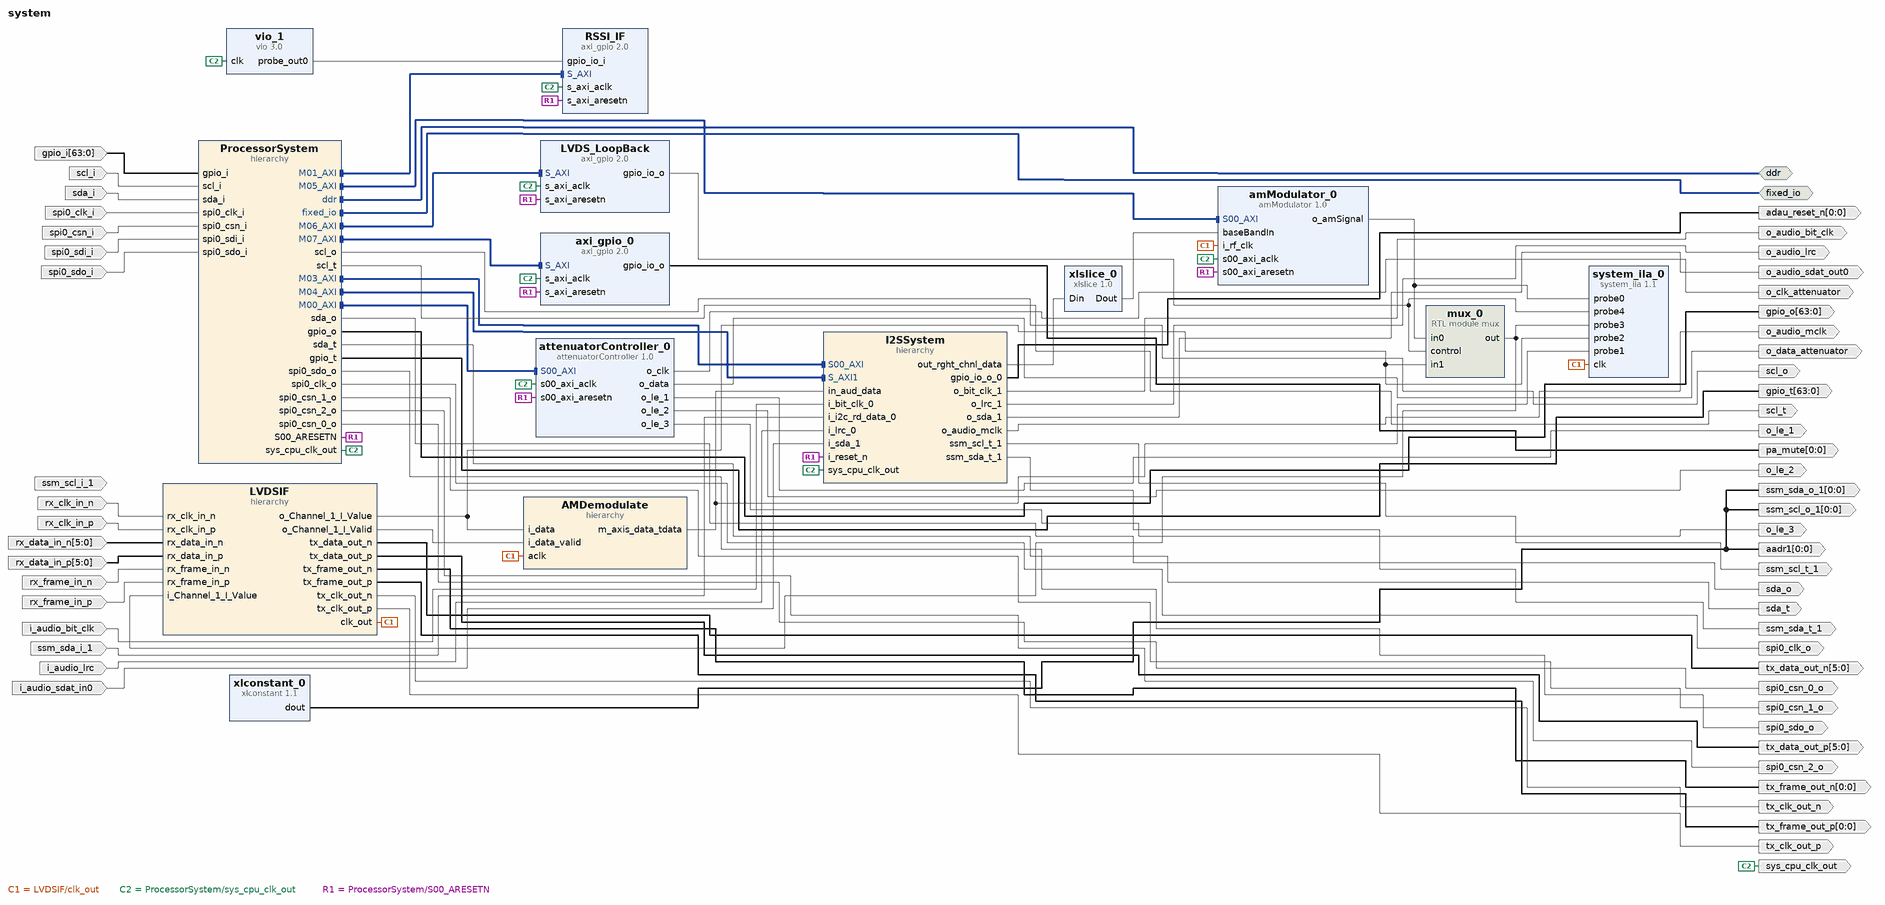
[diagram p0: block diagram of the top level]
# Vivado block design system, xc7z035ifbg676-2L, Vivado 2021.1
create_bd_design system

create_bd_intf_port -mode Master -vlnv xilinx.com:interface:ddrx_rtl:1.0 ddr
create_bd_intf_port -mode Master -vlnv xilinx.com:display_processing_system7:fixedio_rtl:1.0 fixed_io
create_bd_port -dir O spi0_csn_2_o
create_bd_port -dir O spi0_csn_1_o
create_bd_port -dir O spi0_csn_0_o
create_bd_port -dir I spi0_csn_i
create_bd_port -dir I spi0_clk_i
create_bd_port -dir O spi0_clk_o
create_bd_port -dir I spi0_sdo_i
create_bd_port -dir O spi0_sdo_o
create_bd_port -dir I spi0_sdi_i
create_bd_port -dir I -from 63 -to 0 gpio_i
create_bd_port -dir O -from 63 -to 0 gpio_o
create_bd_port -dir O -from 63 -to 0 gpio_t
create_bd_port -dir I rx_clk_in_p
create_bd_port -dir I rx_clk_in_n
create_bd_port -dir I rx_frame_in_p
create_bd_port -dir I rx_frame_in_n
create_bd_port -dir I -from 5 -to 0 rx_data_in_p
create_bd_port -dir I -from 5 -to 0 rx_data_in_n
create_bd_port -dir O tx_clk_out_p
create_bd_port -dir O tx_clk_out_n
create_bd_port -dir O -from 0 -to 0 tx_frame_out_p
create_bd_port -dir O -from 0 -to 0 tx_frame_out_n
create_bd_port -dir O -from 5 -to 0 tx_data_out_p
create_bd_port -dir O -from 5 -to 0 tx_data_out_n
create_bd_port -dir O sys_cpu_clk_out
create_bd_port -dir O sda_o
create_bd_port -dir O sda_t
create_bd_port -dir O scl_o
create_bd_port -dir O scl_t
create_bd_port -dir O -type clk o_audio_mclk
create_bd_port -dir O o_le_2
create_bd_port -dir O o_data_attenuator
create_bd_port -dir O o_le_1
create_bd_port -dir O -type clk o_clk_attenuator
set_property -dict {CONFIG.FREQ_HZ 5000000} [get_bd_ports o_clk_attenuator]
create_bd_port -dir O o_le_3
create_bd_port -dir O -type clk ssm_scl_t_1
set_property -dict {CONFIG.FREQ_HZ 100000} [get_bd_ports ssm_scl_t_1]
create_bd_port -dir O ssm_sda_t_1
create_bd_port -dir O -from 0 -to 0 ssm_scl_o_1
create_bd_port -dir O -from 0 -to 0 ssm_sda_o_1
create_bd_port -dir O -from 0 -to 0 aadr1
create_bd_port -dir I i_audio_lrc
create_bd_port -dir I -type clk i_audio_bit_clk
create_bd_port -dir I i_audio_sdat_in0
create_bd_port -dir O o_audio_lrc
create_bd_port -dir O -type clk o_audio_bit_clk
create_bd_port -dir O o_audio_sdat_out0
create_bd_port -dir O -from 0 -to 0 adau_reset_n
create_bd_port -dir I ssm_sda_i_1
create_bd_port -dir I scl_i
create_bd_port -dir I sda_i
create_bd_port -dir O -from 0 -to 0 pa_mute
create_bd_port -dir I ssm_scl_i_1

create_bd_cell -type hier ProcessorSystem
create_bd_cell -type hier LVDSIF
create_bd_cell -type hier I2SSystem
create_bd_cell -type hier AMDemodulate
create_bd_cell -type ip -vlnv xilinx.com:user:attenuatorController:1.0 attenuatorController_0
create_bd_cell -type ip -vlnv xilinx.com:ip:xlconstant:1.1 xlconstant_0
set_property -dict {CONFIG.CONST_VAL 0} [get_bd_cells xlconstant_0]
create_bd_cell -type ip -vlnv xilinx.com:ip:axi_gpio:2.0 RSSI_IF
set_property -dict {CONFIG.C_ALL_INPUTS 1 CONFIG.C_GPIO_WIDTH 16} [get_bd_cells RSSI_IF]
create_bd_cell -type ip -vlnv xilinx.com:ip:vio:3.0 vio_1
set_property -dict {CONFIG.C_NUM_PROBE_IN 0 CONFIG.C_PROBE_OUT0_WIDTH 16} [get_bd_cells vio_1]
create_bd_cell -type ip -vlnv xilinx.com:ip:axi_gpio:2.0 axi_gpio_0
set_property -dict {CONFIG.C_ALL_OUTPUTS 1 CONFIG.C_GPIO_WIDTH 1} [get_bd_cells axi_gpio_0]
create_bd_cell -type ip -vlnv xilinx.com:ip:xlslice:1.0 xlslice_0
set_property -dict {CONFIG.DIN_FROM 30 CONFIG.DIN_TO 19 CONFIG.DIN_WIDTH 31 CONFIG.DOUT_WIDTH 12} [get_bd_cells xlslice_0]
create_bd_cell -type ip -vlnv xilinx.com:ip:axi_gpio:2.0 LVDS_LoopBack
set_property -dict {CONFIG.C_ALL_OUTPUTS 1 CONFIG.C_GPIO_WIDTH 1} [get_bd_cells LVDS_LoopBack]
create_bd_cell -type module -reference mux mux_0
create_bd_cell -type ip -vlnv xilinx.com:ip:system_ila:1.1 system_ila_0
set_property -dict [list \
  CONFIG.C_DATA_DEPTH 32768 \
  CONFIG.C_MON_TYPE NATIVE \
  CONFIG.C_NUM_OF_PROBES 5 \
  CONFIG.C_PROBE0_TYPE 0 \
  CONFIG.C_PROBE1_TYPE 0 \
  CONFIG.C_PROBE2_TYPE 0 \
  CONFIG.C_PROBE3_TYPE 0 \
] [get_bd_cells system_ila_0]
create_bd_cell -type ip -vlnv xilinx.com:user:amModulator:1.0 amModulator_0

# ---- hierarchy /ProcessorSystem ----
current_bd_instance /ProcessorSystem
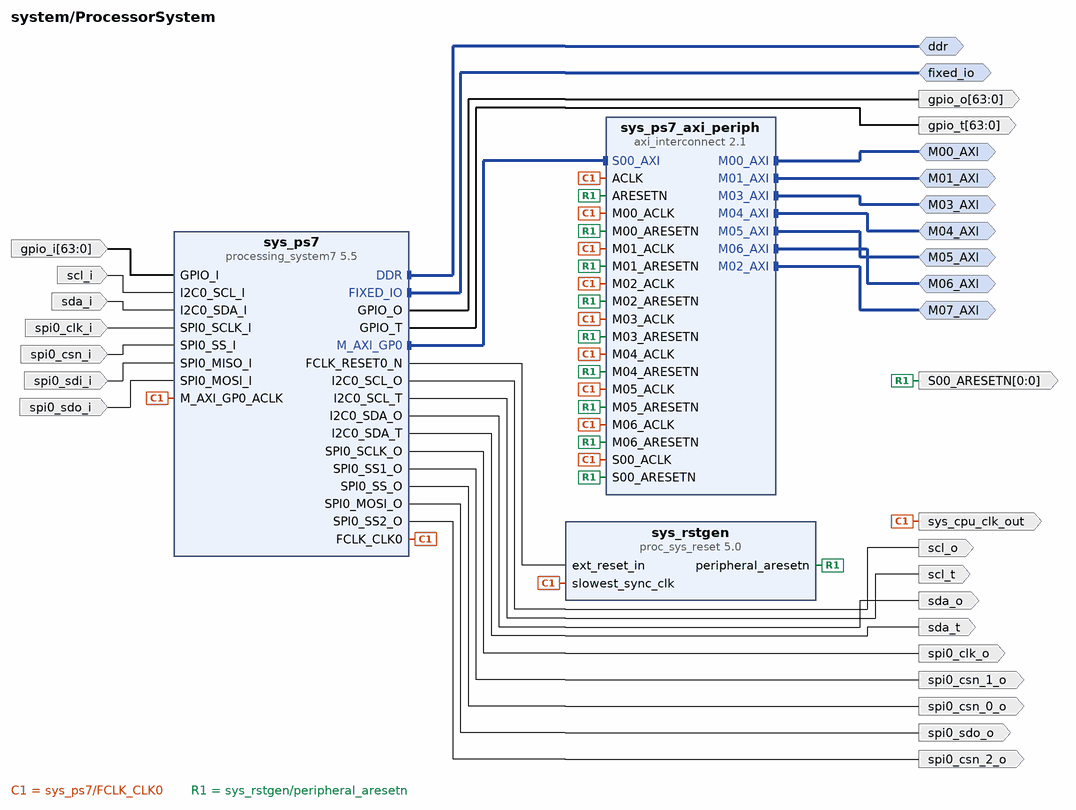
[diagram p1: block diagram inside /ProcessorSystem]
create_bd_intf_pin -mode Master -vlnv xilinx.com:interface:ddrx_rtl:1.0 ddr
create_bd_intf_pin -mode Master -vlnv xilinx.com:display_processing_system7:fixedio_rtl:1.0 fixed_io
create_bd_intf_pin -mode Master -vlnv xilinx.com:interface:aximm_rtl:1.0 M00_AXI
create_bd_intf_pin -mode Master -vlnv xilinx.com:interface:aximm_rtl:1.0 M01_AXI
create_bd_intf_pin -mode Master -vlnv xilinx.com:interface:aximm_rtl:1.0 M03_AXI
create_bd_intf_pin -mode Master -vlnv xilinx.com:interface:aximm_rtl:1.0 M04_AXI
create_bd_intf_pin -mode Master -vlnv xilinx.com:interface:aximm_rtl:1.0 M05_AXI
create_bd_intf_pin -mode Master -vlnv xilinx.com:interface:aximm_rtl:1.0 M07_AXI
create_bd_intf_pin -mode Master -vlnv xilinx.com:interface:aximm_rtl:1.0 M06_AXI
create_bd_pin -dir I -from 63 -to 0 gpio_i
create_bd_pin -dir O -from 63 -to 0 gpio_o
create_bd_pin -dir O -from 63 -to 0 gpio_t
create_bd_pin -dir I spi0_clk_i
create_bd_pin -dir O spi0_clk_o
create_bd_pin -dir I spi0_sdo_i
create_bd_pin -dir O spi0_sdo_o
create_bd_pin -dir I spi0_sdi_i
create_bd_pin -dir I spi0_csn_i
create_bd_pin -dir O spi0_csn_0_o
create_bd_pin -dir O spi0_csn_1_o
create_bd_pin -dir O spi0_csn_2_o
create_bd_pin -dir O -type clk sys_cpu_clk_out
create_bd_pin -dir O -from 0 -to 0 -type rst S00_ARESETN
create_bd_pin -dir I scl_i
create_bd_pin -dir I sda_i
create_bd_pin -dir O sda_o
create_bd_pin -dir O sda_t
create_bd_pin -dir O scl_o
create_bd_pin -dir O scl_t

create_bd_cell -type ip -vlnv xilinx.com:ip:processing_system7:5.5 sys_ps7
set_property -dict [list \
  CONFIG.PCW_APU_PERIPHERAL_FREQMHZ 666.666666 \
  CONFIG.PCW_CPU_CPU_6X4X_MAX_RANGE 800 \
  CONFIG.PCW_ENET0_PERIPHERAL_ENABLE 0 \
  CONFIG.PCW_ENET1_PERIPHERAL_CLKSRC External \
  CONFIG.PCW_EN_RST1_PORT 1 \
  CONFIG.PCW_EN_RST2_PORT 1 \
  CONFIG.PCW_FPGA0_PERIPHERAL_FREQMHZ 100.0 \
  CONFIG.PCW_FPGA1_PERIPHERAL_FREQMHZ 200.0 \
  CONFIG.PCW_FPGA2_PERIPHERAL_FREQMHZ 200.0 \
  CONFIG.PCW_GPIO_EMIO_GPIO_ENABLE 1 \
  CONFIG.PCW_GPIO_EMIO_GPIO_IO 64 \
  CONFIG.PCW_GPIO_MIO_GPIO_ENABLE 1 \
  CONFIG.PCW_GPIO_MIO_GPIO_IO MIO \
  CONFIG.PCW_I2C0_I2C0_IO EMIO \
  CONFIG.PCW_I2C0_PERIPHERAL_ENABLE 1 \
  CONFIG.PCW_I2C_PERIPHERAL_FREQMHZ 111.111115 \
  CONFIG.PCW_I2C_RESET_ENABLE 1 \
  CONFIG.PCW_I2C_RESET_SELECT {Share reset pin} \
  CONFIG.PCW_IRQ_F2P_MODE REVERSE \
  CONFIG.PCW_PERIPHERAL_BOARD_PRESET None \
  CONFIG.PCW_PRESET_BANK0_VOLTAGE {LVCMOS 1.8V} \
  CONFIG.PCW_PRESET_BANK1_VOLTAGE {LVCMOS 1.8V} \
  CONFIG.PCW_QSPI_GRP_SINGLE_SS_ENABLE 1 \
  CONFIG.PCW_QSPI_GRP_SINGLE_SS_IO {MIO 1 .. 6} \
  CONFIG.PCW_QSPI_PERIPHERAL_ENABLE 1 \
  CONFIG.PCW_QSPI_QSPI_IO {MIO 1 .. 6} \
  CONFIG.PCW_SD0_GRP_CD_ENABLE 1 \
  CONFIG.PCW_SD0_GRP_CD_IO {MIO 50} \
  CONFIG.PCW_SD0_GRP_WP_ENABLE 0 \
  CONFIG.PCW_SD0_PERIPHERAL_ENABLE 1 \
  CONFIG.PCW_SD0_SD0_IO {MIO 40 .. 45} \
  CONFIG.PCW_SDIO_PERIPHERAL_FREQMHZ 50 \
  CONFIG.PCW_SINGLE_QSPI_DATA_MODE x4 \
  CONFIG.PCW_SPI0_PERIPHERAL_ENABLE 1 \
  CONFIG.PCW_SPI0_SPI0_IO EMIO \
  CONFIG.PCW_SPI1_PERIPHERAL_ENABLE 1 \
  CONFIG.PCW_SPI1_SPI1_IO EMIO \
  CONFIG.PCW_UART1_PERIPHERAL_ENABLE 1 \
  CONFIG.PCW_UART1_UART1_IO {MIO 48 .. 49} \
  CONFIG.PCW_UART_PERIPHERAL_FREQMHZ 100 \
  CONFIG.PCW_UIPARAM_DDR_FREQ_MHZ 533.333333 \
  CONFIG.PCW_UIPARAM_DDR_PARTNO {MT41K256M16 RE-125} \
  CONFIG.PCW_USB0_PERIPHERAL_ENABLE 0 \
  CONFIG.PCW_USB_RESET_ENABLE 1 \
  CONFIG.preset None \
] [get_bd_cells sys_ps7]
# 494 more settings of sys_ps7 are not shown: defaults, MIO pin electricals, DDR timing, and values the tool derives
create_bd_cell -type ip -vlnv xilinx.com:ip:proc_sys_reset:5.0 sys_rstgen
set_property -dict {CONFIG.C_EXT_RST_WIDTH 1} [get_bd_cells sys_rstgen]
create_bd_cell -type ip -vlnv xilinx.com:ip:axi_interconnect:2.1 sys_ps7_axi_periph
set_property -dict {CONFIG.NUM_MI 7} [get_bd_cells sys_ps7_axi_periph]

# ---- hierarchy /LVDSIF ----
current_bd_instance /LVDSIF
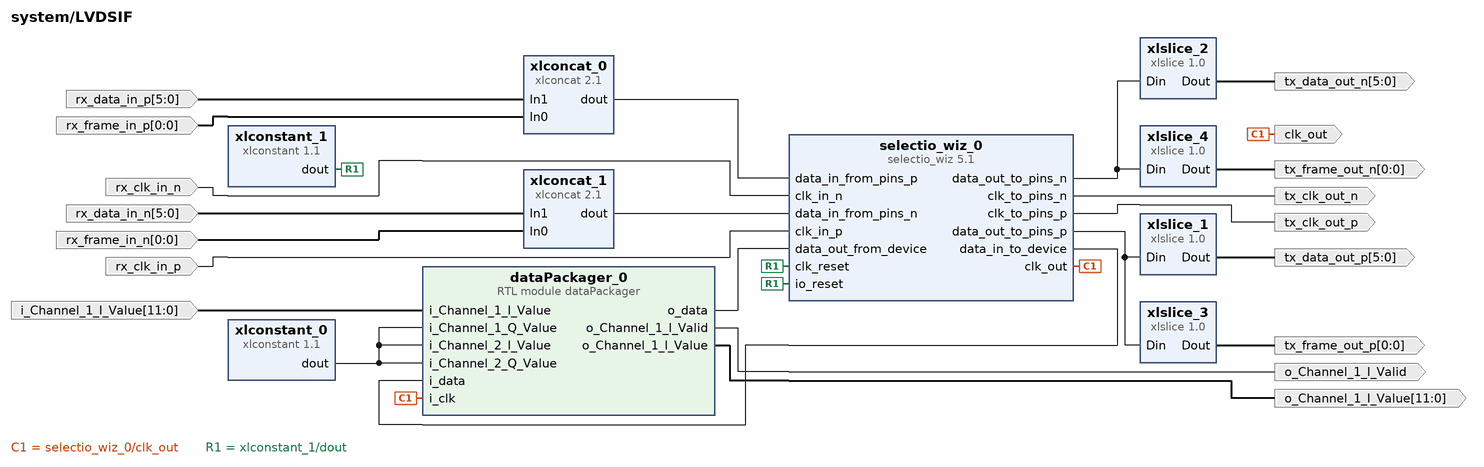
[diagram p2: block diagram inside /LVDSIF]
create_bd_pin -dir I -from 5 -to 0 rx_data_in_p
create_bd_pin -dir I -from 0 -to 0 rx_frame_in_p
create_bd_pin -dir I -from 5 -to 0 rx_data_in_n
create_bd_pin -dir I -from 0 -to 0 rx_frame_in_n
create_bd_pin -dir I -from 11 -to 0 i_Channel_1_I_Value
create_bd_pin -dir I -type clk rx_clk_in_p
create_bd_pin -dir I -type clk rx_clk_in_n
create_bd_pin -dir O -type clk tx_clk_out_p
create_bd_pin -dir O -type clk tx_clk_out_n
create_bd_pin -dir O -from 0 -to 0 tx_frame_out_p
create_bd_pin -dir O -from 5 -to 0 tx_data_out_p
create_bd_pin -dir O -from 5 -to 0 tx_data_out_n
create_bd_pin -dir O -from 0 -to 0 tx_frame_out_n
create_bd_pin -dir O -from 11 -to 0 o_Channel_1_I_Value
create_bd_pin -dir O o_Channel_1_I_Valid
create_bd_pin -dir O -type clk clk_out

create_bd_cell -type ip -vlnv xilinx.com:ip:selectio_wiz:5.1 selectio_wiz_0
set_property -dict [list \
  CONFIG.BUS_DIR SEPARATE \
  CONFIG.BUS_IO_STD LVDS \
  CONFIG.BUS_SIG_TYPE DIFF \
  CONFIG.CLK_FWD true \
  CONFIG.CLK_FWD_IO_STD LVDS \
  CONFIG.CLK_FWD_SIG_TYPE DIFF \
  CONFIG.SELIO_ACTIVE_EDGE DDR \
  CONFIG.SELIO_BUS_IN_DELAY NONE \
  CONFIG.SELIO_CLK_IO_STD LVDS \
  CONFIG.SELIO_CLK_SIG_TYPE DIFF \
  CONFIG.SELIO_INTERFACE_TYPE NETWORKING \
  CONFIG.SERIALIZATION_FACTOR 4 \
  CONFIG.SYSTEM_DATA_WIDTH 7 \
] [get_bd_cells selectio_wiz_0]
create_bd_cell -type ip -vlnv xilinx.com:ip:xlconcat:2.1 xlconcat_0
set_property -dict {CONFIG.dout_width 7} [get_bd_cells xlconcat_0]
create_bd_cell -type ip -vlnv xilinx.com:ip:xlconcat:2.1 xlconcat_1
set_property -dict {CONFIG.dout_width 7} [get_bd_cells xlconcat_1]
create_bd_cell -type ip -vlnv xilinx.com:ip:xlconstant:1.1 xlconstant_0
set_property -dict {CONFIG.CONST_VAL 0 CONFIG.CONST_WIDTH 12} [get_bd_cells xlconstant_0]
create_bd_cell -type ip -vlnv xilinx.com:ip:xlconstant:1.1 xlconstant_1
set_property -dict {CONFIG.CONST_VAL 0} [get_bd_cells xlconstant_1]
create_bd_cell -type ip -vlnv xilinx.com:ip:xlslice:1.0 xlslice_1
set_property -dict {CONFIG.DIN_FROM 6 CONFIG.DIN_TO 1 CONFIG.DIN_WIDTH 7 CONFIG.DOUT_WIDTH 6} [get_bd_cells xlslice_1]
create_bd_cell -type ip -vlnv xilinx.com:ip:xlslice:1.0 xlslice_2
set_property -dict {CONFIG.DIN_FROM 6 CONFIG.DIN_TO 1 CONFIG.DIN_WIDTH 7 CONFIG.DOUT_WIDTH 6} [get_bd_cells xlslice_2]
create_bd_cell -type ip -vlnv xilinx.com:ip:xlslice:1.0 xlslice_3
set_property -dict {CONFIG.DIN_FROM 0 CONFIG.DIN_TO 0 CONFIG.DIN_WIDTH 7 CONFIG.DOUT_WIDTH 1} [get_bd_cells xlslice_3]
create_bd_cell -type ip -vlnv xilinx.com:ip:xlslice:1.0 xlslice_4
set_property -dict {CONFIG.DIN_FROM 0 CONFIG.DIN_TO 0 CONFIG.DIN_WIDTH 7 CONFIG.DOUT_WIDTH 1} [get_bd_cells xlslice_4]
create_bd_cell -type module -reference dataPackager dataPackager_0

# ---- hierarchy /I2SSystem ----
current_bd_instance /I2SSystem
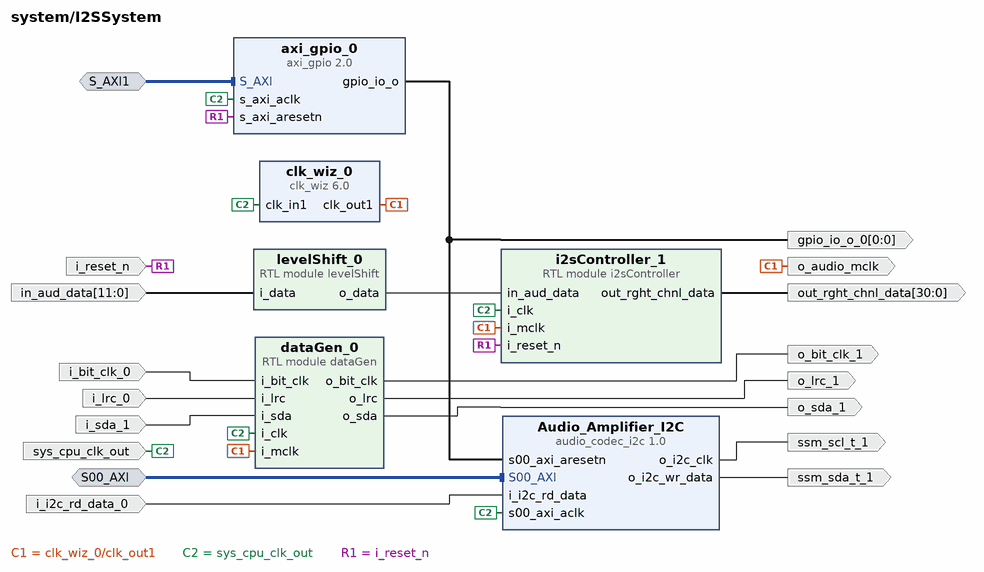
[diagram p3: block diagram inside /I2SSystem]
create_bd_intf_pin -mode Slave -vlnv xilinx.com:interface:aximm_rtl:1.0 S_AXI1
create_bd_intf_pin -mode Slave -vlnv xilinx.com:interface:aximm_rtl:1.0 S00_AXI
create_bd_pin -dir I -type clk sys_cpu_clk_out
create_bd_pin -dir I i_reset_n
create_bd_pin -dir O -from 30 -to 0 out_rght_chnl_data
create_bd_pin -dir I -from 11 -to 0 in_aud_data
create_bd_pin -dir I i_lrc_0
create_bd_pin -dir I -type clk i_bit_clk_0
create_bd_pin -dir I i_sda_1
create_bd_pin -dir O o_lrc_1
create_bd_pin -dir O -type clk o_bit_clk_1
create_bd_pin -dir O o_sda_1
create_bd_pin -dir O -from 0 -to 0 gpio_io_o_0
create_bd_pin -dir O ssm_sda_t_1
create_bd_pin -dir O -type clk ssm_scl_t_1
create_bd_pin -dir I i_i2c_rd_data_0
create_bd_pin -dir O -type clk o_audio_mclk

create_bd_cell -type module -reference dataGen dataGen_0
create_bd_cell -type ip -vlnv xilinx.com:ip:axi_gpio:2.0 axi_gpio_0
set_property -dict {CONFIG.C_ALL_OUTPUTS 1 CONFIG.C_DOUT_DEFAULT 0x00000001 CONFIG.C_GPIO_WIDTH 1} [get_bd_cells axi_gpio_0]
create_bd_cell -type ip -vlnv xilinx.com:user:audio_codec_i2c:1.0 Audio_Amplifier_I2C
create_bd_cell -type ip -vlnv xilinx.com:ip:clk_wiz:6.0 clk_wiz_0
set_property -dict [list \
  CONFIG.CLKOUT1_JITTER 360.948 \
  CONFIG.CLKOUT1_PHASE_ERROR 301.601 \
  CONFIG.CLKOUT1_REQUESTED_OUT_FREQ 12.288 \
  CONFIG.CLKOUT2_JITTER 287.104 \
  CONFIG.CLKOUT2_PHASE_ERROR 318.151 \
  CONFIG.CLKOUT2_REQUESTED_OUT_FREQ 128 \
  CONFIG.CLKOUT2_USED false \
  CONFIG.CLKOUT3_JITTER 535.299 \
  CONFIG.CLKOUT3_PHASE_ERROR 318.151 \
  CONFIG.CLKOUT3_REQUESTED_OUT_FREQ 5 \
  CONFIG.CLKOUT3_USED false \
  CONFIG.MMCM_CLKFBOUT_MULT_F 48.000 \
  CONFIG.MMCM_CLKOUT0_DIVIDE_F 78.125 \
  CONFIG.MMCM_CLKOUT1_DIVIDE 1 \
  CONFIG.MMCM_CLKOUT2_DIVIDE 1 \
  CONFIG.MMCM_DIVCLK_DIVIDE 5 \
  CONFIG.NUM_OUT_CLKS 1 \
  CONFIG.USE_LOCKED false \
  CONFIG.USE_RESET false \
] [get_bd_cells clk_wiz_0]
create_bd_cell -type module -reference i2sController i2sController_1
create_bd_cell -type module -reference levelShift levelShift_0

# ---- hierarchy /AMDemodulate ----
current_bd_instance /AMDemodulate
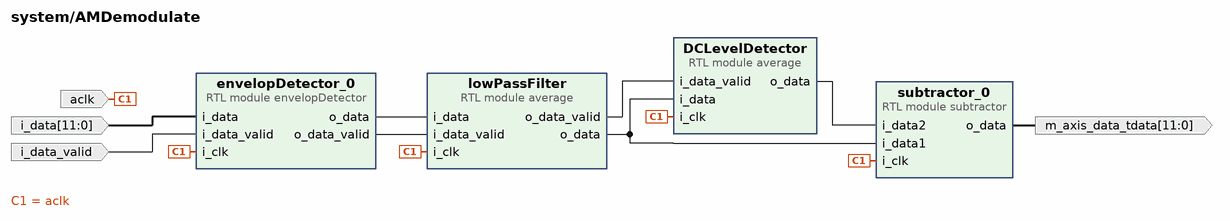
[diagram p4: block diagram inside /AMDemodulate]
create_bd_pin -dir I -type clk aclk
create_bd_pin -dir O -from 11 -to 0 m_axis_data_tdata
create_bd_pin -dir I -from 11 -to 0 i_data
create_bd_pin -dir I i_data_valid

create_bd_cell -type module -reference envelopDetector envelopDetector_0
create_bd_cell -type module -reference average lowPassFilter
create_bd_cell -type module -reference average DCLevelDetector
set_property -dict {CONFIG.numSamples 32768} [get_bd_cells DCLevelDetector]
create_bd_cell -type module -reference subtractor subtractor_0

# ---- connections ----

current_bd_instance /ProcessorSystem
connect_bd_intf_net [get_bd_intf_pins M03_AXI] [get_bd_intf_pins sys_ps7_axi_periph/M03_AXI]
connect_bd_intf_net [get_bd_intf_pins M04_AXI] [get_bd_intf_pins sys_ps7_axi_periph/M04_AXI]
connect_bd_intf_net [get_bd_intf_pins M06_AXI] [get_bd_intf_pins sys_ps7_axi_periph/M06_AXI]
connect_bd_intf_net [get_bd_intf_pins ddr] [get_bd_intf_pins sys_ps7/DDR]
connect_bd_intf_net [get_bd_intf_pins fixed_io] [get_bd_intf_pins sys_ps7/FIXED_IO]
connect_bd_intf_net [get_bd_intf_pins sys_ps7/M_AXI_GP0] [get_bd_intf_pins sys_ps7_axi_periph/S00_AXI]
connect_bd_intf_net [get_bd_intf_pins M00_AXI] [get_bd_intf_pins sys_ps7_axi_periph/M00_AXI]
connect_bd_intf_net [get_bd_intf_pins M01_AXI] [get_bd_intf_pins sys_ps7_axi_periph/M01_AXI]
connect_bd_intf_net [get_bd_intf_pins M07_AXI] [get_bd_intf_pins sys_ps7_axi_periph/M02_AXI]
connect_bd_intf_net [get_bd_intf_pins M05_AXI] [get_bd_intf_pins sys_ps7_axi_periph/M05_AXI]
connect_bd_net [get_bd_pins gpio_i] [get_bd_pins sys_ps7/GPIO_I]
connect_bd_net [get_bd_pins scl_i] [get_bd_pins sys_ps7/I2C0_SCL_I]
connect_bd_net [get_bd_pins sda_i] [get_bd_pins sys_ps7/I2C0_SDA_I]
connect_bd_net [get_bd_pins spi0_clk_i] [get_bd_pins sys_ps7/SPI0_SCLK_I]
connect_bd_net [get_bd_pins spi0_csn_i] [get_bd_pins sys_ps7/SPI0_SS_I]
connect_bd_net [get_bd_pins spi0_sdi_i] [get_bd_pins sys_ps7/SPI0_MISO_I]
connect_bd_net [get_bd_pins spi0_sdo_i] [get_bd_pins sys_ps7/SPI0_MOSI_I]
connect_bd_net -net sys_cpu_clk [get_bd_pins sys_ps7/FCLK_CLK0] \
  [get_bd_pins sys_cpu_clk_out] [get_bd_pins sys_rstgen/slowest_sync_clk] [get_bd_pins sys_ps7/M_AXI_GP0_ACLK] \
  [get_bd_pins sys_ps7_axi_periph/ACLK] [get_bd_pins sys_ps7_axi_periph/S00_ACLK] [get_bd_pins sys_ps7_axi_periph/M00_ACLK] \
  [get_bd_pins sys_ps7_axi_periph/M01_ACLK] [get_bd_pins sys_ps7_axi_periph/M02_ACLK] \
  [get_bd_pins sys_ps7_axi_periph/M03_ACLK] [get_bd_pins sys_ps7_axi_periph/M04_ACLK] \
  [get_bd_pins sys_ps7_axi_periph/M05_ACLK] [get_bd_pins sys_ps7_axi_periph/M06_ACLK]
connect_bd_net -net sys_cpu_resetn [get_bd_pins sys_rstgen/peripheral_aresetn] \
  [get_bd_pins S00_ARESETN] [get_bd_pins sys_ps7_axi_periph/ARESETN] [get_bd_pins sys_ps7_axi_periph/S00_ARESETN] \
  [get_bd_pins sys_ps7_axi_periph/M00_ARESETN] [get_bd_pins sys_ps7_axi_periph/M01_ARESETN] \
  [get_bd_pins sys_ps7_axi_periph/M02_ARESETN] [get_bd_pins sys_ps7_axi_periph/M03_ARESETN] \
  [get_bd_pins sys_ps7_axi_periph/M04_ARESETN] [get_bd_pins sys_ps7_axi_periph/M05_ARESETN] \
  [get_bd_pins sys_ps7_axi_periph/M06_ARESETN]
connect_bd_net [get_bd_pins sys_ps7/FCLK_RESET0_N] [get_bd_pins sys_rstgen/ext_reset_in]
connect_bd_net [get_bd_pins sys_ps7/GPIO_O] [get_bd_pins gpio_o]
connect_bd_net [get_bd_pins sys_ps7/GPIO_T] [get_bd_pins gpio_t]
connect_bd_net [get_bd_pins sys_ps7/I2C0_SCL_O] [get_bd_pins scl_o]
connect_bd_net [get_bd_pins sys_ps7/I2C0_SCL_T] [get_bd_pins scl_t]
connect_bd_net [get_bd_pins sys_ps7/I2C0_SDA_O] [get_bd_pins sda_o]
connect_bd_net [get_bd_pins sys_ps7/I2C0_SDA_T] [get_bd_pins sda_t]
connect_bd_net [get_bd_pins sys_ps7/SPI0_MOSI_O] [get_bd_pins spi0_sdo_o]
connect_bd_net [get_bd_pins sys_ps7/SPI0_SCLK_O] [get_bd_pins spi0_clk_o]
connect_bd_net [get_bd_pins sys_ps7/SPI0_SS1_O] [get_bd_pins spi0_csn_1_o]
connect_bd_net [get_bd_pins sys_ps7/SPI0_SS2_O] [get_bd_pins spi0_csn_2_o]
connect_bd_net [get_bd_pins sys_ps7/SPI0_SS_O] [get_bd_pins spi0_csn_0_o]
set_property HDL_ATTRIBUTE.BMM_INFO_PROCESSOR {arm > system axi_bram_ctrl_0} [get_bd_cells sys_ps7]
set_property HDL_ATTRIBUTE.KEEP_HIERARCHY yes [get_bd_cells sys_ps7]

current_bd_instance /LVDSIF
connect_bd_net -net amModulator_0_o_amSignal [get_bd_pins i_Channel_1_I_Value] [get_bd_pins dataPackager_0/i_Channel_1_I_Value]
connect_bd_net [get_bd_pins dataPackager_0/o_Channel_1_I_Valid] [get_bd_pins o_Channel_1_I_Valid]
connect_bd_net -net dataPackager_0_o_Channel_1_I_Value [get_bd_pins dataPackager_0/o_Channel_1_I_Value] [get_bd_pins o_Channel_1_I_Value]
connect_bd_net [get_bd_pins dataPackager_0/o_data] [get_bd_pins selectio_wiz_0/data_out_from_device]
connect_bd_net [get_bd_pins rx_clk_in_n] [get_bd_pins selectio_wiz_0/clk_in_n]
connect_bd_net [get_bd_pins rx_clk_in_p] [get_bd_pins selectio_wiz_0/clk_in_p]
connect_bd_net [get_bd_pins rx_data_in_n] [get_bd_pins xlconcat_1/In1]
connect_bd_net [get_bd_pins rx_data_in_p] [get_bd_pins xlconcat_0/In1]
connect_bd_net [get_bd_pins rx_frame_in_n] [get_bd_pins xlconcat_1/In0]
connect_bd_net [get_bd_pins rx_frame_in_p] [get_bd_pins xlconcat_0/In0]
connect_bd_net [get_bd_pins selectio_wiz_0/clk_out] [get_bd_pins clk_out] [get_bd_pins dataPackager_0/i_clk]
connect_bd_net [get_bd_pins selectio_wiz_0/clk_to_pins_n] [get_bd_pins tx_clk_out_n]
connect_bd_net [get_bd_pins selectio_wiz_0/clk_to_pins_p] [get_bd_pins tx_clk_out_p]
connect_bd_net [get_bd_pins selectio_wiz_0/data_in_to_device] [get_bd_pins dataPackager_0/i_data]
connect_bd_net [get_bd_pins selectio_wiz_0/data_out_to_pins_n] [get_bd_pins xlslice_2/Din] [get_bd_pins xlslice_4/Din]
connect_bd_net [get_bd_pins selectio_wiz_0/data_out_to_pins_p] [get_bd_pins xlslice_1/Din] [get_bd_pins xlslice_3/Din]
connect_bd_net [get_bd_pins xlconcat_0/dout] [get_bd_pins selectio_wiz_0/data_in_from_pins_p]
connect_bd_net [get_bd_pins xlconcat_1/dout] [get_bd_pins selectio_wiz_0/data_in_from_pins_n]
connect_bd_net [get_bd_pins xlconstant_0/dout] \
  [get_bd_pins dataPackager_0/i_Channel_1_Q_Value] [get_bd_pins dataPackager_0/i_Channel_2_I_Value] \
  [get_bd_pins dataPackager_0/i_Channel_2_Q_Value]
connect_bd_net [get_bd_pins xlconstant_1/dout] [get_bd_pins selectio_wiz_0/clk_reset] [get_bd_pins selectio_wiz_0/io_reset]
connect_bd_net [get_bd_pins xlslice_1/Dout] [get_bd_pins tx_data_out_p]
connect_bd_net [get_bd_pins xlslice_2/Dout] [get_bd_pins tx_data_out_n]
connect_bd_net [get_bd_pins xlslice_3/Dout] [get_bd_pins tx_frame_out_p]
connect_bd_net [get_bd_pins xlslice_4/Dout] [get_bd_pins tx_frame_out_n]
set_property HDL_ATTRIBUTE.DEBUG true [get_bd_nets amModulator_0_o_amSignal]
set_property HDL_ATTRIBUTE.DEBUG true [get_bd_nets dataPackager_0_o_Channel_1_I_Value]

current_bd_instance /I2SSystem
connect_bd_intf_net [get_bd_intf_pins S_AXI1] [get_bd_intf_pins axi_gpio_0/S_AXI]
connect_bd_intf_net [get_bd_intf_pins S00_AXI] [get_bd_intf_pins Audio_Amplifier_I2C/S00_AXI]
connect_bd_net [get_bd_pins Audio_Amplifier_I2C/o_i2c_clk] [get_bd_pins ssm_scl_t_1]
connect_bd_net [get_bd_pins Audio_Amplifier_I2C/o_i2c_wr_data] [get_bd_pins ssm_sda_t_1]
connect_bd_net [get_bd_pins axi_gpio_0/gpio_io_o] [get_bd_pins gpio_io_o_0] [get_bd_pins Audio_Amplifier_I2C/s00_axi_aresetn]
connect_bd_net [get_bd_pins clk_wiz_0/clk_out1] [get_bd_pins o_audio_mclk] [get_bd_pins dataGen_0/i_mclk] [get_bd_pins i2sController_1/i_mclk]
connect_bd_net [get_bd_pins dataGen_0/o_bit_clk] [get_bd_pins o_bit_clk_1]
connect_bd_net [get_bd_pins dataGen_0/o_lrc] [get_bd_pins o_lrc_1]
connect_bd_net [get_bd_pins dataGen_0/o_sda] [get_bd_pins o_sda_1]
connect_bd_net [get_bd_pins i2sController_1/out_rght_chnl_data] [get_bd_pins out_rght_chnl_data]
connect_bd_net -net i_bit_clk_0_1 [get_bd_pins i_bit_clk_0] [get_bd_pins dataGen_0/i_bit_clk]
connect_bd_net -net i_i2c_rd_data_0_1 [get_bd_pins i_i2c_rd_data_0] [get_bd_pins Audio_Amplifier_I2C/i_i2c_rd_data]
connect_bd_net -net i_lrc_0_1 [get_bd_pins i_lrc_0] [get_bd_pins dataGen_0/i_lrc]
connect_bd_net -net i_sda_1_1 [get_bd_pins i_sda_1] [get_bd_pins dataGen_0/i_sda]
connect_bd_net -net in_aud_data_1 [get_bd_pins in_aud_data] [get_bd_pins levelShift_0/i_data]
connect_bd_net [get_bd_pins levelShift_0/o_data] [get_bd_pins i2sController_1/in_aud_data]
connect_bd_net -net sys_cpu_clk [get_bd_pins sys_cpu_clk_out] \
  [get_bd_pins dataGen_0/i_clk] [get_bd_pins axi_gpio_0/s_axi_aclk] [get_bd_pins Audio_Amplifier_I2C/s00_axi_aclk] \
  [get_bd_pins clk_wiz_0/clk_in1] [get_bd_pins i2sController_1/i_clk]
connect_bd_net -net sys_cpu_resetn [get_bd_pins i_reset_n] [get_bd_pins axi_gpio_0/s_axi_aresetn] [get_bd_pins i2sController_1/i_reset_n]
set_property HDL_ATTRIBUTE.DEBUG true [get_bd_nets in_aud_data_1]

current_bd_instance /AMDemodulate
connect_bd_net [get_bd_pins DCLevelDetector/o_data] [get_bd_pins subtractor_0/i_data2]
connect_bd_net -net LVDSIF_clk_out [get_bd_pins aclk] \
  [get_bd_pins envelopDetector_0/i_clk] [get_bd_pins lowPassFilter/i_clk] [get_bd_pins DCLevelDetector/i_clk] \
  [get_bd_pins subtractor_0/i_clk]
connect_bd_net [get_bd_pins envelopDetector_0/o_data] [get_bd_pins lowPassFilter/i_data]
connect_bd_net [get_bd_pins envelopDetector_0/o_data_valid] [get_bd_pins lowPassFilter/i_data_valid]
connect_bd_net -net i_data_1 [get_bd_pins i_data] [get_bd_pins envelopDetector_0/i_data]
connect_bd_net [get_bd_pins i_data_valid] [get_bd_pins envelopDetector_0/i_data_valid]
connect_bd_net [get_bd_pins lowPassFilter/o_data] [get_bd_pins DCLevelDetector/i_data] [get_bd_pins subtractor_0/i_data1]
connect_bd_net [get_bd_pins lowPassFilter/o_data_valid] [get_bd_pins DCLevelDetector/i_data_valid]
connect_bd_net -net subtractor_0_o_data [get_bd_pins subtractor_0/o_data] [get_bd_pins m_axis_data_tdata]
set_property HDL_ATTRIBUTE.DEBUG true [get_bd_nets i_data_1]
set_property HDL_ATTRIBUTE.DEBUG true [get_bd_nets subtractor_0_o_data]

current_bd_instance /
connect_bd_intf_net [get_bd_intf_pins ProcessorSystem/M00_AXI] [get_bd_intf_pins attenuatorController_0/S00_AXI]
connect_bd_intf_net [get_bd_intf_pins ProcessorSystem/M01_AXI] [get_bd_intf_pins RSSI_IF/S_AXI]
connect_bd_intf_net [get_bd_intf_pins ProcessorSystem/M03_AXI] [get_bd_intf_pins I2SSystem/S00_AXI]
connect_bd_intf_net [get_bd_intf_pins ProcessorSystem/M04_AXI] [get_bd_intf_pins I2SSystem/S_AXI1]
connect_bd_intf_net [get_bd_intf_pins ProcessorSystem/M05_AXI] [get_bd_intf_pins amModulator_0/S00_AXI]
connect_bd_intf_net [get_bd_intf_pins LVDS_LoopBack/S_AXI] [get_bd_intf_pins ProcessorSystem/M06_AXI]
connect_bd_intf_net [get_bd_intf_pins axi_gpio_0/S_AXI] [get_bd_intf_pins ProcessorSystem/M07_AXI]
connect_bd_intf_net -intf_net sys_ps7_DDR [get_bd_intf_ports ddr] [get_bd_intf_pins ProcessorSystem/ddr]
connect_bd_intf_net -intf_net sys_ps7_FIXED_IO [get_bd_intf_ports fixed_io] [get_bd_intf_pins ProcessorSystem/fixed_io]
connect_bd_net [get_bd_pins I2SSystem/gpio_io_o_0] [get_bd_ports adau_reset_n]
connect_bd_net [get_bd_pins I2SSystem/o_bit_clk_1] [get_bd_ports o_audio_bit_clk]
connect_bd_net [get_bd_pins I2SSystem/o_lrc_1] [get_bd_ports o_audio_lrc]
connect_bd_net [get_bd_pins I2SSystem/o_sda_1] [get_bd_ports o_audio_sdat_out0]
connect_bd_net [get_bd_pins I2SSystem/ssm_scl_t_1] [get_bd_ports ssm_scl_t_1]
connect_bd_net [get_bd_pins I2SSystem/ssm_sda_t_1] [get_bd_ports ssm_sda_t_1]
connect_bd_net [get_bd_pins LVDSIF/clk_out] [get_bd_pins AMDemodulate/aclk] [get_bd_pins system_ila_0/clk] [get_bd_pins amModulator_0/i_rf_clk]
connect_bd_net [get_bd_pins LVDSIF/o_Channel_1_I_Valid] [get_bd_pins AMDemodulate/i_data_valid]
connect_bd_net -net LVDSIF_o_Channel_1_I_Value [get_bd_pins LVDSIF/o_Channel_1_I_Value] \
  [get_bd_pins AMDemodulate/i_data] [get_bd_pins mux_0/in1] [get_bd_pins system_ila_0/probe2]
connect_bd_net [get_bd_pins LVDSIF/tx_data_out_n] [get_bd_ports tx_data_out_n]
connect_bd_net [get_bd_pins LVDSIF/tx_data_out_p] [get_bd_ports tx_data_out_p]
connect_bd_net [get_bd_pins LVDSIF/tx_frame_out_n] [get_bd_ports tx_frame_out_n]
connect_bd_net [get_bd_pins LVDSIF/tx_frame_out_p] [get_bd_ports tx_frame_out_p]
connect_bd_net [get_bd_pins ProcessorSystem/scl_o] [get_bd_ports scl_o]
connect_bd_net [get_bd_pins ProcessorSystem/scl_t] [get_bd_ports scl_t]
connect_bd_net [get_bd_pins ProcessorSystem/sda_o] [get_bd_ports sda_o]
connect_bd_net [get_bd_pins ProcessorSystem/sda_t] [get_bd_ports sda_t]
connect_bd_net -net amModulator_0_o_amSignal [get_bd_pins amModulator_0/o_amSignal] [get_bd_pins mux_0/in0] [get_bd_pins system_ila_0/probe0]
connect_bd_net [get_bd_pins attenuatorController_0/o_clk] [get_bd_ports o_clk_attenuator]
connect_bd_net [get_bd_pins attenuatorController_0/o_data] [get_bd_ports o_data_attenuator]
connect_bd_net [get_bd_pins attenuatorController_0/o_le_1] [get_bd_ports o_le_1]
connect_bd_net [get_bd_pins attenuatorController_0/o_le_2] [get_bd_ports o_le_2]
connect_bd_net [get_bd_pins attenuatorController_0/o_le_3] [get_bd_ports o_le_3]
connect_bd_net [get_bd_pins axi_gpio_0/gpio_io_o] [get_bd_ports pa_mute]
connect_bd_net -net axi_gpio_1_gpio_io_o [get_bd_pins LVDS_LoopBack/gpio_io_o] [get_bd_pins mux_0/control] [get_bd_pins system_ila_0/probe4]
connect_bd_net -net clk_wiz_0_clk_out1 [get_bd_pins I2SSystem/o_audio_mclk] [get_bd_ports o_audio_mclk]
connect_bd_net -net fir_compiler_0_m_axis_data_tdata [get_bd_pins AMDemodulate/m_axis_data_tdata] \
  [get_bd_pins I2SSystem/in_aud_data] [get_bd_pins system_ila_0/probe1]
connect_bd_net [get_bd_ports gpio_i] [get_bd_pins ProcessorSystem/gpio_i]
connect_bd_net -net i2sController_1_out_rght_chnl_data [get_bd_pins I2SSystem/out_rght_chnl_data] [get_bd_pins xlslice_0/Din]
connect_bd_net -net i_bit_clk_0_1 [get_bd_ports i_audio_bit_clk] [get_bd_pins I2SSystem/i_bit_clk_0]
connect_bd_net -net i_i2c_rd_data_0_1 [get_bd_ports ssm_sda_i_1] [get_bd_pins I2SSystem/i_i2c_rd_data_0]
connect_bd_net -net i_lrc_0_1 [get_bd_ports i_audio_lrc] [get_bd_pins I2SSystem/i_lrc_0]
connect_bd_net -net i_sda_0_1 [get_bd_ports i_audio_sdat_in0] [get_bd_pins I2SSystem/i_sda_1]
connect_bd_net -net mux_0_out [get_bd_pins mux_0/out] [get_bd_pins LVDSIF/i_Channel_1_I_Value] [get_bd_pins system_ila_0/probe3]
connect_bd_net [get_bd_ports rx_clk_in_n] [get_bd_pins LVDSIF/rx_clk_in_n]
connect_bd_net [get_bd_ports rx_clk_in_p] [get_bd_pins LVDSIF/rx_clk_in_p]
connect_bd_net [get_bd_ports rx_data_in_n] [get_bd_pins LVDSIF/rx_data_in_n]
connect_bd_net [get_bd_ports rx_data_in_p] [get_bd_pins LVDSIF/rx_data_in_p]
connect_bd_net [get_bd_ports rx_frame_in_n] [get_bd_pins LVDSIF/rx_frame_in_n]
connect_bd_net [get_bd_ports rx_frame_in_p] [get_bd_pins LVDSIF/rx_frame_in_p]
connect_bd_net [get_bd_ports scl_i] [get_bd_pins ProcessorSystem/scl_i]
connect_bd_net [get_bd_ports sda_i] [get_bd_pins ProcessorSystem/sda_i]
connect_bd_net -net selectio_wiz_0_clk_to_pins_n [get_bd_pins LVDSIF/tx_clk_out_n] [get_bd_ports tx_clk_out_n]
connect_bd_net -net selectio_wiz_0_clk_to_pins_p [get_bd_pins LVDSIF/tx_clk_out_p] [get_bd_ports tx_clk_out_p]
connect_bd_net [get_bd_ports spi0_clk_i] [get_bd_pins ProcessorSystem/spi0_clk_i]
connect_bd_net [get_bd_ports spi0_csn_i] [get_bd_pins ProcessorSystem/spi0_csn_i]
connect_bd_net [get_bd_ports spi0_sdi_i] [get_bd_pins ProcessorSystem/spi0_sdi_i]
connect_bd_net [get_bd_ports spi0_sdo_i] [get_bd_pins ProcessorSystem/spi0_sdo_i]
connect_bd_net -net sys_cpu_clk [get_bd_pins ProcessorSystem/sys_cpu_clk_out] \
  [get_bd_ports sys_cpu_clk_out] [get_bd_pins I2SSystem/sys_cpu_clk_out] [get_bd_pins attenuatorController_0/s00_axi_aclk] \
  [get_bd_pins RSSI_IF/s_axi_aclk] [get_bd_pins vio_1/clk] [get_bd_pins axi_gpio_0/s_axi_aclk] \
  [get_bd_pins LVDS_LoopBack/s_axi_aclk] [get_bd_pins amModulator_0/s00_axi_aclk]
connect_bd_net -net sys_cpu_resetn [get_bd_pins ProcessorSystem/S00_ARESETN] \
  [get_bd_pins I2SSystem/i_reset_n] [get_bd_pins attenuatorController_0/s00_axi_aresetn] [get_bd_pins RSSI_IF/s_axi_aresetn] \
  [get_bd_pins axi_gpio_0/s_axi_aresetn] [get_bd_pins LVDS_LoopBack/s_axi_aresetn] \
  [get_bd_pins amModulator_0/s00_axi_aresetn]
connect_bd_net -net sys_ps7_GPIO_O [get_bd_pins ProcessorSystem/gpio_o] [get_bd_ports gpio_o]
connect_bd_net -net sys_ps7_GPIO_T [get_bd_pins ProcessorSystem/gpio_t] [get_bd_ports gpio_t]
connect_bd_net -net sys_ps7_SPI0_MOSI_O [get_bd_pins ProcessorSystem/spi0_sdo_o] [get_bd_ports spi0_sdo_o]
connect_bd_net -net sys_ps7_SPI0_SCLK_O [get_bd_pins ProcessorSystem/spi0_clk_o] [get_bd_ports spi0_clk_o]
connect_bd_net -net sys_ps7_SPI0_SS1_O [get_bd_pins ProcessorSystem/spi0_csn_1_o] [get_bd_ports spi0_csn_1_o]
connect_bd_net -net sys_ps7_SPI0_SS2_O [get_bd_pins ProcessorSystem/spi0_csn_2_o] [get_bd_ports spi0_csn_2_o]
connect_bd_net -net sys_ps7_SPI0_SS_O [get_bd_pins ProcessorSystem/spi0_csn_0_o] [get_bd_ports spi0_csn_0_o]
connect_bd_net [get_bd_pins vio_1/probe_out0] [get_bd_pins RSSI_IF/gpio_io_i]
connect_bd_net [get_bd_pins xlconstant_0/dout] [get_bd_ports ssm_scl_o_1] [get_bd_ports ssm_sda_o_1] [get_bd_ports aadr1]
connect_bd_net [get_bd_pins xlslice_0/Dout] [get_bd_pins amModulator_0/baseBandIn]
set_property HDL_ATTRIBUTE.DEBUG true [get_bd_nets LVDSIF_o_Channel_1_I_Value]
set_property HDL_ATTRIBUTE.MARK_DEBUG true [get_bd_nets LVDSIF_o_Channel_1_I_Value]
set_property HDL_ATTRIBUTE.DEBUG true [get_bd_nets amModulator_0_o_amSignal]
set_property HDL_ATTRIBUTE.MARK_DEBUG true [get_bd_nets amModulator_0_o_amSignal]
set_property HDL_ATTRIBUTE.DEBUG true [get_bd_nets axi_gpio_1_gpio_io_o]
set_property HDL_ATTRIBUTE.MARK_DEBUG true [get_bd_nets axi_gpio_1_gpio_io_o]
set_property HDL_ATTRIBUTE.DEBUG true [get_bd_nets fir_compiler_0_m_axis_data_tdata]
set_property HDL_ATTRIBUTE.MARK_DEBUG true [get_bd_nets fir_compiler_0_m_axis_data_tdata]
set_property HDL_ATTRIBUTE.DEBUG true [get_bd_nets mux_0_out]
set_property HDL_ATTRIBUTE.MARK_DEBUG true [get_bd_nets mux_0_out]

# ---- address map ----
assign_bd_address -offset 0x41200000 -range 64K -target_address_space [get_bd_addr_spaces ProcessorSystem/sys_ps7/Data] [get_bd_addr_segs I2SSystem/axi_gpio_0/S_AXI/Reg]
assign_bd_address -offset 0x41210000 -range 64K -target_address_space [get_bd_addr_spaces ProcessorSystem/sys_ps7/Data] [get_bd_addr_segs LVDS_LoopBack/S_AXI/Reg]
assign_bd_address -offset 0x41220000 -range 64K -target_address_space [get_bd_addr_spaces ProcessorSystem/sys_ps7/Data] [get_bd_addr_segs RSSI_IF/S_AXI/Reg]
assign_bd_address -offset 0x41250000 -range 64K -target_address_space [get_bd_addr_spaces ProcessorSystem/sys_ps7/Data] [get_bd_addr_segs axi_gpio_0/S_AXI/Reg]
assign_bd_address -offset 0x43C00000 -range 64K -target_address_space [get_bd_addr_spaces ProcessorSystem/sys_ps7/Data] [get_bd_addr_segs attenuatorController_0/S00_AXI/S00_AXI_reg]
assign_bd_address -offset 0x43C10000 -range 64K -target_address_space [get_bd_addr_spaces ProcessorSystem/sys_ps7/Data] [get_bd_addr_segs I2SSystem/Audio_Amplifier_I2C/S00_AXI/S00_AXI_reg]
assign_bd_address -offset 0x43C20000 -range 64K -target_address_space [get_bd_addr_spaces ProcessorSystem/sys_ps7/Data] [get_bd_addr_segs amModulator_0/S00_AXI/S00_AXI_reg]

validate_bd_design
save_bd_design
